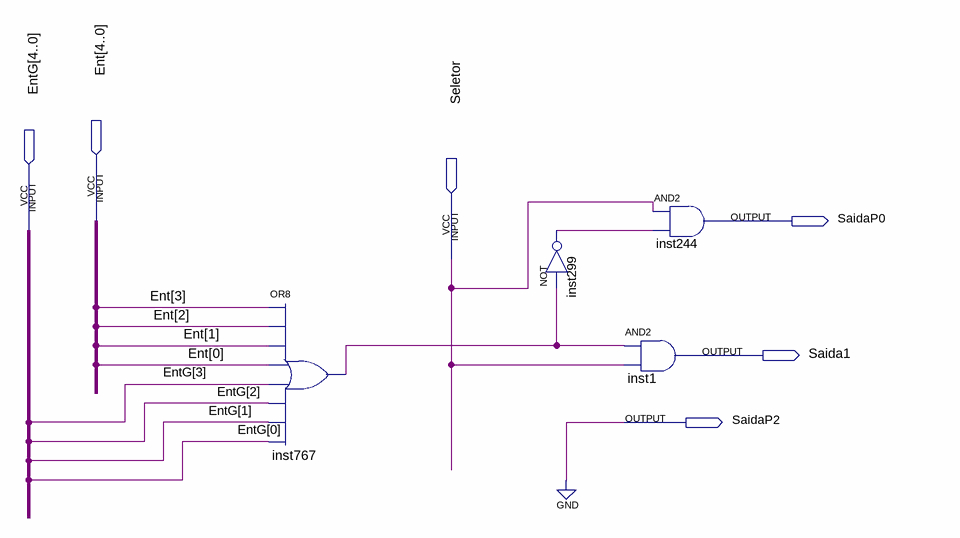
[diagram p0: schematic sheet]
// Quartus schematic Comp10.bdf as structural Verilog: 4 symbols, 6 pins
module Comp10 (
  input  [4:0] Ent,
  input  [4:0] EntG,
  input  Seletor,
  output SaidaP0,
  output Saida1,
  output SaidaP2
);

  wire inst299_out, inst767_out;

  or inst767 (inst767_out, Ent[3], Ent[2], Ent[1], Ent[0], EntG[3], EntG[2], EntG[1], EntG[0]);
  not inst299 (inst299_out, inst767_out);
  and inst1 (Saida1, inst767_out, Seletor);
  and inst244 (SaidaP0, Seletor, inst299_out);

  assign SaidaP2 = 1'b0;
endmodule
